# EasyEDA Pro project ProProject_BBM-USB_2024-03-22.epro, board PCB_BSBM-USB-O_2
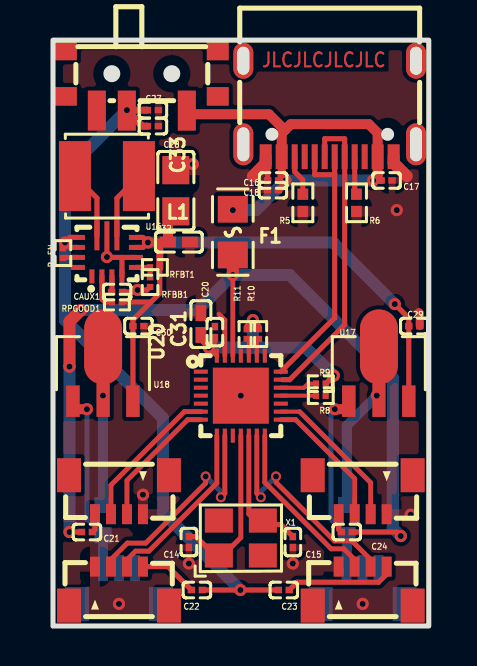
[diagram p9: board, top side]
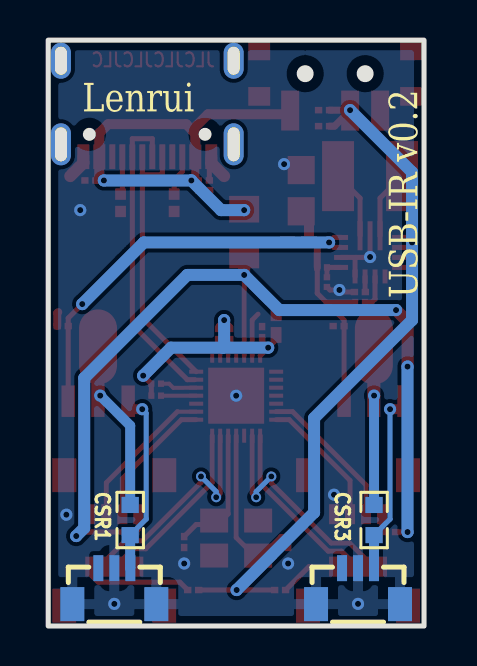
[diagram p10: board, bottom side, seen from below]

Outline 18.8 x 29.3 mm; copper layers: Top Layer, Bottom Layer. Coordinates in mm from the lower left corner of the outline.
Outline path: rectangle 0,29.3 18.8,0
Stack: Top Layer 0.035mm / Dielectric1 1.51mm FR4 er 4.5 / Bottom Layer 0.035mm

## Design rules (mm)
spacing Default (default): track to track 0.152, other pairs 0 to 0.152
track width Default (default): min 0.254, default 0.254, max 25.4
differential pair differentialPair (default): width min 0.127, default 0.254, max 2.54; gap min 0.152, default 0.152
via Default (default): diameter min 0.61, default 0.61, max 100.025; hole min 0.305, default 0.305, max 59.995

## Placement (name value [footprint] x y rotation side)
C14  12pF  [C0201]  6.8 4.2 270 top
C15  12pF  [C0201]  12 4.2 270 top
C16  100uF  [C0201]  11.01 22.28 180 top
C17  100uF  [C0201]  16.69 22.28 0 top
C18  100nF  [C0201]  11 21.8 180 top
C20  100nF  [C0201]  8.1 14.7 90 top
C21  100uF  [C0201]  1.7 4.7 0 top
C22  100uF  [C0201]  7.2 1.8 180 top
C23  100uF  [C0201]  11.55 1.8 0 top
C24  100uF  [C0201]  14.7 4.7 180 top
C27  22uF  [C0201]  5 25.8 0 top
C28  22uF  [C0201]  5 25 0 top
C29  100nF  [C0201]  18.07 15 180 top
C30  100nF  [C0201]  4.27 15 0 top
C31  10uF  [C0402]  7.4 15.1 90 top
C32  10uF  [C0402]  6.3 19.2 0 top
C33  47uF  [C0805]  6.15 21.77 90 top
CAUX1  100nF  [C0201]  3.21 16.7 0 top
CSR1  536Ω  [R0603]  14.7 5.3 270 bottom
CSR3  536Ω  [R0603]  2.5 5.3 270 bottom
F1  SMD0805B050TF  [F0805]  9 19.7 270 top
L1  2.2uH  [IND-SMD_L4.0-W4.0]  2.7 22.5 0 top
P1  SM03B-SURS-TF(LF)(SN)  [CONN-SMD_SM03B-SURS-TF-LF-SN]  3.3 1.99 0 bottom
P2  SM03B-SURS-TF(LF)(SN)  [CONN-SMD_SM03B-SURS-TF-LF-SN]  15.49 1.99 0 bottom
R5  5.1kΩ  [R0402]  12.5 21.17 90 top
R6  5.1kΩ  [R0402]  15.18 21.17 90 top
R8  DNP(56K)  [R0201]  13.4 11.52 180 top
R9  DNP(56K)  [R0201]  13.4 12.12 180 top
R10  DNP(56K)  [R0201]  10.3 14.6 270 top
R11  DNP(56K)  [R0201]  9.7 14.6 270 top
R-EN  10kΩ  [R0201]  0.5 18.65 270 top
RFBB1  100kΩ  [R0201]  4.86 17.2 90 top
RFBT1  845kΩ  [R0201]  5.1 17.93 0 top
RPGOOD1  100kΩ  [R0201]  3.2 16.2 0 top
SW1  MK-12C02-G020  [SW-SMD_MK-12C02-G020]  4.44 27.27 180 top
U12  SM04B-SURS-TF(LF)(SN)  [CONN-SMD_SM04B-SURS-TF-LF-SN]  3.3 6.57 180 top
U13  SM04B-SURS-TF(LF)(SN)  [CONN-SMD_SM04B-SURS-TF-LF-SN]  3.3 1.99 0 top
U14  SM04B-SURS-TF(LF)(SN)  [CONN-SMD_SM04B-SURS-TF-LF-SN]  15.49 1.99 0 top
U15  SM04B-SURS-TF(LF)(SN)  [CONN-SMD_SM04B-SURS-TF-LF-SN]  15.49 6.57 180 top
U16  TPS63070RNMR  [VQFN-HR-15_L3.0-W2.5-P0.50-BL_TPS63070RNMR]  2.7 18.5 0 top
U17  LM317LIPK  [SOT-89_L4.5-W2.5-P1.50-LS4.2-BR]  16.3 12.6 270 top
U18  LM317LIPK  [SOT-89_L4.5-W2.5-P1.50-LS4.2-BR]  2.5 12.6 270 top
U19  GT-USB-7010ASV  [USB-C-SMD_G-SWITCH_GT-USB-7010ASV]  13.84 25.87 180 top
U20  CH335F  [QFN-28_L4.0-W4.0-P0.40-TL-EP2.8]  9.4 11.52 0 top
X1  12MHz  [OSC-SMD_4P-L3.2-W2.5-BL]  9.4 4.4 0 top

## Footprints (pads in the part's own frame, mm; a bottom-side part is the same pattern mirrored in y, then rotated)
C0201
  rect 0.368x0.324 smd: 1(-0.275,0) 2(0.275,0)
C0402
  rect 0.79x0.54 smd: 1(-0.545,0) 2(0.545,0)
C0805
  rect 1.41x1.35 smd: 1(-1.03,0) 2(1.03,0)
CONN-SMD_SM03B-SURS-TF-LF-SN
  rect 0.5x1.3 smd: 1(0.8,-0.899) 2(0,-0.899) 3(-0.8,-0.9)
  rect 1.2x1.7 smd: 4(-2.1,0.9) 5(2.1,0.9)
CONN-SMD_SM04B-SURS-TF-LF-SN
  rect 0.5x1 smd: 1(-1.2,0.975) 2(-0.4,0.975) 3(0.4,0.975) 4(1.2,0.975)
  rect 1.2x1.7 smd: 5(2.5,-0.975) 6(-2.5,-0.975)
F0805
  rect 1.335x1.5 smd: 1(-1.143,0) 2(1.143,0)
IND-SMD_L4.0-W4.0
  rect 1.6x3.5 smd: 1(-1.6,0) 2(1.6,0)
OSC-SMD_4P-L3.2-W2.5-BL
  rect 1.4x1.2 smd: 1(-1.1,-0.875) 2(1.1,-0.875) 3(1.1,0.875) 4(-1.1,0.875)
QFN-28_L4.0-W4.0-P0.40-TL-EP2.8
  rect 0.7x0.2 smd: 1(-2,1.2) 2(-2,0.8) 3(-2,0.4) 4(-2,0.001) 5(-2,-0.4) 6(-2,-0.8) 7(-2,-1.2) 15(2,-1.2) 16(2,-0.8) 17(2,-0.4) 18(2,0) 19(2,0.4) 20(2,0.8) 21(2,1.2)
  rect 0.2x0.7 smd: 8(-1.2,-2) 9(-0.8,-2) 10(-0.4,-2) 11(0,-2) 12(0.4,-2) 13(0.8,-2) 14(1.2,-2) 22(1.2,2) 23(0.8,2) 24(0.4,2) 25(0,2) 26(-0.4,2) 27(-0.8,2) 28(-1.2,2)
  rect 2.8x2.8 smd: 29(0.001,-0.001)
R0201
  rect 0.303x0.324 smd: 1(-0.241,0) 2(0.241,0)
R0402
  rect 0.566x0.54 smd: 1(-0.433,0) 2(0.433,0)
R0603
  rect 0.806x0.864 smd: 1(-0.753,0) 2(0.753,0)
SOT-89_L4.5-W2.5-P1.50-LS4.2-BR
  rect 1.575x0.672 smd: 1(1.356,-1.5) 3(1.356,1.5)
  custom 5.377x1.9 smd: 2(-1.356,0.009)
SW-SMD_MK-12C02-G020
  rect 0.9x2 smd: 1(-2.25,1.49) 2(0.75,1.49) 3(2.25,1.49)
  rect 1.1x0.93 smd: 4(3.8,0.779) 5(3.8,-1.49) 6(-3.8,-1.49) 7(-3.8,0.779)
USB-C-SMD_G-SWITCH_GT-USB-7010ASV
  oval 1x2.1 hole 0.6x1.7: 1(-4.32,1.78) 2(4.32,1.78)
  oval 1x1.8 hole 0.6x1.4: 3(4.32,-2.4) 4(-4.32,-2.4)
  rect 0.6x1.24 smd: A1B12(-3.2,2.4) A4B9(-2.4,2.4) B1A12(3.2,2.4) B4A9(2.4,2.4)
  rect 0.3x1.24 smd: A5(-1.25,2.4) A6(-0.25,2.4) A7(0.25,2.4) A8(1.25,2.4) B5(1.75,2.4) B6(0.75,2.4) B7(-0.75,2.4) B8(-1.75,2.4)
VQFN-HR-15_L3.0-W2.5-P0.50-BL_TPS63070RNMR
  rect 0.25x0.7 smd: 1(-0.75,-1.016) 2(-0.25,-1.016) 3(0.25,-1.016) 4(0.75,-1.016)
  rect 0.7x0.25 smd: 5(1.45,-0.566) 6(1.45,-0.066) 7(1.45,0.434) 8(1.45,0.934) 12(-1.45,0.434) 13(-1.45,0.934) 14(-1.45,-0.066) 15(-1.45,-0.566)
  rect 0.25x1.45 smd: 9(0.5,1.016) 11(-0.5,1.016)
  rect 0.25x1.85 smd: 10(0,0.817)

## Nets
7.5VO: C29.2 C30.1 C32.1 C33.1 RFBT1.2 RPGOOD1.2 U16.7 U16.8 U17.3 U18.3
GND: C14.2 C15.2 C16.2 C17.2 C18.2 C20.2 C27.2 C28.2 C29.1 C30.2 C31.2 C32.2 C33.2 CAUX1.2 P1.2 P1.4 P1.5 P2.2 P2.4 P2.5 R5.1 R6.1 RFBB1.1 U12.1 U13.1 U14.1 U15.1 U16.4 U16.6 U16.10 U19.A1B12 U19.B1A12 U20.27 U20.29
VCC5: C21.1 C24.1 F1.2 U20.26
VCC33: C20.1 C31.1 R8.1 R9.1 R10.1 R11.1 U20.28
VIN: C16.1 C17.1 C18.1 F1.1 SW1.1 U19.A4B9 U19.B4A9
CSR1: CSR1.1 U17.2
CSR3: CSR3.1 U18.2
DM1: U12.3 U20.6
DM2: U13.3 U20.8
DM3: U14.3 U20.13
DM4: U15.3 U20.15
DMU: U19.A7 U19.B7 U20.20
DP1: U12.2 U20.7
DP2: U13.2 U20.9
DP3: U14.2 U20.14
DP4: U15.2 U20.16
DPU: U19.A6 U19.B6 U20.21
EN: R-EN.2 U16.14
FB: RFBB1.2 RFBT1.1 U16.5
IRO1: CSR3.2 P1.3 U18.1
IRO2: CSR1.2 P2.3 U17.1
L1: L1.1 U16.11
L2: L1.2 U16.9
LED1: U20.1
LED2: U20.3
LED3: U20.22
LED4: U20.25
OVCUR1: R11.2 U20.24
OVCUR2: R10.2 U20.23
OVCUR3: R9.2 U20.19
OVCUR4: R8.2 U20.18
PG: RPGOOD1.1 U16.2
PWREN1: U20.4
PWREN2: U20.2
PWREN3: U20.10
PWREN4: U20.5
USBO: C22.1 C23.1 C27.1 C28.1 R-EN.1 SW1.2 U16.12 U16.13
VAUX: CAUX1.1 U16.3
XI: C14.1 U20.11 X1.1
XO: C15.1 U20.12 X1.3
$1N11513: R5.2 U19.B5
$1N11542: R6.2 U19.A5
$1N15806: C22.2 U13.4
$1N15811: C21.2 U12.4
$1N15821: C24.2 U15.4
$1N17969: C23.2 U14.4

Pads without a net: P1 1; P2 1; SW1 3 4 5 6 7; U12 5 6; U13 5 6; U14 5 6; U15 5 6; U16 1 15; U19 1 2 3 4 A8 B8; U20 17; X1 2 4

## Via types
v1: diameter 0.61, hole 0.305, Top Layer to Bottom Layer, 31 vias
v2: diameter 0.5, hole 0.3, Top Layer to Bottom Layer, 4 vias

## Routing (per net, layer and track width the routed paths; a pad name or vN(x,y) marks a point on that pad's centre or on a via; arc(x,y) is an arc through that point)
7.5VO: length 33.4
  Top Layer w0.254: C30.1 4,15.3 4.9,16.2 ; v1(17.1,16.1) 17.8,15.4 17.8,14.9 ; U16.8 4.5,19.43 v1(4.75,19.18) 4.5,18.93 U16.7 ; 4.9,16.2 3.54,16.2 ; 4.9,16.2 5.34,16.64 RFBT1.2 ; 4,10.64 4,14.94 ; 17.8,10.64 17.8,14.83
  Top Layer w0.35: RFBT1.2 5.34,18.94
  Top Layer w0.4: v1(4.75,19.18) 5.54,19.18 5.56,19.2
  Top Layer w0.5: C33.1 5.75,20.35 C32.1
  Bottom Layer w0.6: v1(4.75,19.18) 14.02,19.18 v1(17.1,16.1)
GND: length 10.5
  Top Layer w0.24: U20.27 8.6,15.3 8.3,15.6
  Top Layer w0.254: CAUX1.2 4.13,16.7 v1(4.23,16.81) 4.71,16.81 RFBB1.1 ; U16.6 3.41,18.43 ; 3.41,18.43 3.45,18.39 U16.4 ; 3.41,18.43 2.72,18.43 v1(2.7,18.45) ; 10.64,23.47 10.74,23.37 C16.2
  Top Layer w0.4: C29.1 18.35,15.65 18.3,15.7
  Top Layer w0.6: 17.7,22.5 17.04,23.16 17.04,23.47 ; 10,22.5 10.64,23.14 10.64,23.47
  vias: v1(3.3,1.11) v1(4.5,6.57) v1(6.8,3.13) v1(7,23.1) v1(9.4,11.52) v1(12,3.13) v1(15.49,1.11) v1(17.2,20.8) v1(17.89,5.57)
VCC5: length 46
  Top Layer w0.24: v1(9,17.56) U20.26
  Top Layer w0.254: C24.1 17.2,4.7 v1(17.4,4.5) ; C21.1 v1(0.83,4.7)
  Top Layer w0.6: v1(1.4,15.8) 0.83,15.23 v1(0.83,12.97) ; F1.2 v1(9,17.56)
  Bottom Layer w0.254: v1(0.83,12.97) 0.8,13
  Bottom Layer w0.6: v1(1.4,15.8) 7.24,15.8 v1(9,17.56) 11.84,17.56 17,12.4 17,4.9 v1(17.4,4.5) ; v1(0.83,4.7) v1(0.83,12.97)
VCC33: length 13
  Top Layer w0.254: R11.1 9.7,15 v1(10,15.3) 10.3,15 R10.1 ; R8.1 13.64,12.11 14.05,12.52 14.04,12.52 R9.1 ; v1(7.8,13.92) 7.5,14.22 7.5,14.43 ; v1(7.8,13.92) U20.28 ; v1(7.8,13.92) 8.1,14.22 C20.1
  Bottom Layer w0.6: 10.06,13.92 10,13.98 v1(10,15.3) ; 10.06,13.92 v1(7.8,13.92) ; 10.06,13.92 12.65,13.92 v1(14.05,12.52)
VIN: length 24.4
  Top Layer w0.254: C16.1 v1(11.64,22.28)
  Top Layer w0.35: C18.1 11.64,22.17 v1(11.64,22.28) ; v1(16.02,22.28) C17.1
  Top Layer w0.4: 11.44,23.47 11.44,22.48 v1(11.64,22.28)
  Top Layer w0.5: 11.44,23.47 11.44,24.64 11.6,24.8 ; 11.6,24.8 10.81,25.59 6.88,25.59 SW1.1 ; 11.6,24.8 11.9,25.1 15.8,25.1 16.24,24.66 16.24,22.51 v1(16.02,22.28)
  Bottom Layer w0.6: v1(16.02,22.28) v1(11.64,22.28) 10.16,20.8 v1(9,20.8)
CSR1: length 6.1
  Bottom Layer w0.5: CSR1.1 14.7,10.02 v1(16.2,11.52)
CSR3: length 5.5
  Bottom Layer w0.5: CSR3.1 v1(2.5,11.52)
DM1: length 7.5
  Top Layer w0.245: 7.4,10.72 6.57,10.72 2.9,7.05 U12.3
DM2: length 8.8
  Top Layer w0.245: U20.8 8.2,7.14 4.8,3.74 4.13,3.74 3.7,3.32 U13.3
DM3: length 11.5
  Top Layer w0.245: v2(11.16,7.48) 11.16,7.18 14.08,4.26 14.95,4.26 15.89,3.32 U14.3 ; v2(10.4,6.44) 10.2,6.64 U20.13
  Bottom Layer w0.254: v2(10.4,6.44) 10.4,6.72 v2(11.16,7.48)
DM4: length 6.7
  Top Layer w0.245: U20.15 12.14,10.32 15.09,7.37 U15.3
DMU: length 15.5
  Top Layer w0.254: 13.59,23.47 13.59,24.37 14.59,24.37 14.59,23.47 14.59,15.07 11.84,12.32 11.47,12.32
DP1: length 6.6
  Top Layer w0.245: U12.2 3.7,7.28 6.74,10.32 U20.7
DP2: length 11.5
  Top Layer w0.245: v2(8.4,6.44) 8.6,6.64 U20.9 ; U13.2 2.9,3.33 3.72,4.15 4.64,4.15 7.64,7.15 v2(7.64,7.48)
  Bottom Layer w0.254: v2(7.64,7.48) 8.4,6.72 v2(8.4,6.44)
DP3: length 8.8
  Top Layer w0.245: U20.14 10.6,7.18 13.92,3.86 14.55,3.86 15.09,3.32 U14.2
DP4: length 7.5
  Top Layer w0.2: 12.34,10.72 U20.16
  Top Layer w0.245: U15.2 15.89,7.17 12.34,10.72
DPU: length 13.8
  Top Layer w0.254: 14.09,22.62 14.05,22.57 13.09,22.57 13.09,23.47 ; 14.09,22.62 14.09,15.41 U20.21 ; 14.09,22.62 14.09,23.47
EN: length 0.8
  Top Layer w0.254: U16.14 0.53,18.43 R-EN.2
FB: length 1.2
  Top Layer w0.254: U16.5 RFBT1.1 RFBB1.2
IRO1: length 9
  Top Layer w0.5: v1(1.7,10.84) 1,10.84
  Bottom Layer w0.254: v1(1.7,10.84) 1.7,5.35 CSR3.2 ; 2.5,2.9 2.5,2.89
  Bottom Layer w0.5: CSR3.2 2.5,4.54 P1.3
IRO2: length 9.1
  Top Layer w0.5: 14.8,10.84 v1(14.1,10.84)
  Bottom Layer w0.254: CSR1.2 13.9,5.35 13.9,10.64 v1(14.1,10.84)
  Bottom Layer w0.5: P2.3 14.7,2.9 CSR1.2
L1: length 3.4
  Top Layer w0.254: U16.11 2.2,21.4 L1.1
L2: length 3.4
  Top Layer w0.254: U16.9 3.2,21.4 L1.2
OVCUR1: length 0.9
  Top Layer w0.2: R11.2 9.8,14.26 U20.24
OVCUR2: length 0.9
  Top Layer w0.2: R10.2 10.2,14.26 U20.23
OVCUR3: length 1.8
  Top Layer w0.2: U20.19 12.55,11.91 12.75,12.12 R9.2
OVCUR4: length 1.8
  Top Layer w0.2: U20.18 R8.2
PG: length 1.7
  Top Layer w0.254: U16.2 2.45,16.35 2.6,16.2 RPGOOD1.1
USBO: length 37
  Top Layer w0.254: C22.1 v1(9.37,1.8) C23.1 ; U16.13 0.85,19.43 v1(0.6,19.18) ; v1(0.6,19.18) 0.6,18.99 R-EN.1 ; v1(0.6,19.18) 0.85,18.93 U16.12 ; 3.72,25.8 SW1.2
  Top Layer w0.35: C28.1 4.47,25 SW1.2 ; C27.1 3.72,25.8
  Bottom Layer w0.6: v1(3.7,25.8) 0.6,22.7 v1(0.6,19.18) 0.6,15.3 5.5,10.4 5.5,5.67 v1(9.37,1.8)
VAUX: length 0.8
  Top Layer w0.254: CAUX1.1 2.95,16.72 U16.3
XI: length 8.6
  Top Layer w0.245: U20.11 9.4,4.42 8.3,3.33
  Top Layer w0.254: C14.1 7.15,4.47 8.3,3.33
XO: length 6.6
  Top Layer w0.245: U20.12 9.8,5.6 10.32,5.08 10.5,5.08
  Top Layer w0.254: C15.1 11.4,5.08 10.5,5.08
$1N11513: length 2
  Top Layer w0.254: 12.09,23.47 12.09,22.72 12.5,22.32 12.5,21.63
$1N11542: length 1.9
  Top Layer w0.254: R6.2 15.09,21.69 15.09,23.47
$1N15806: length 2.9
  Top Layer w0.254: C22.2 5.76,2.97 U13.4
$1N15811: length 0.9
  Top Layer w0.254: U12.4 2.1,4.83 C21.2
$1N15821: length 0.9
  Top Layer w0.254: C24.2 14.29,4.83 U15.4
$1N17969: length 5.6
  Top Layer w0.254: 11.82,1.8 12.21,2.19 16.29,2.19 16.69,2.59 U14.4

## Copper pours and planes (outline as drawn; the poured copper is in the pictures)
GND on Top Layer: -2.74,31.39 18.85,31.39 18.85,-0.23 -2.74,-0.23
GND on Bottom Layer: -0.25,29.6 21.34,29.6 21.34,-2.03 -0.25,-2.03

## Text on the board
Bottom Silkscreen Layer: USB-IR v0.2 | Lenrui
Top Layer: JLCJLCJLCJLC
